# EAGLE schematic MCP3424 Temperature board V2 (EAGLE 7.5.0)
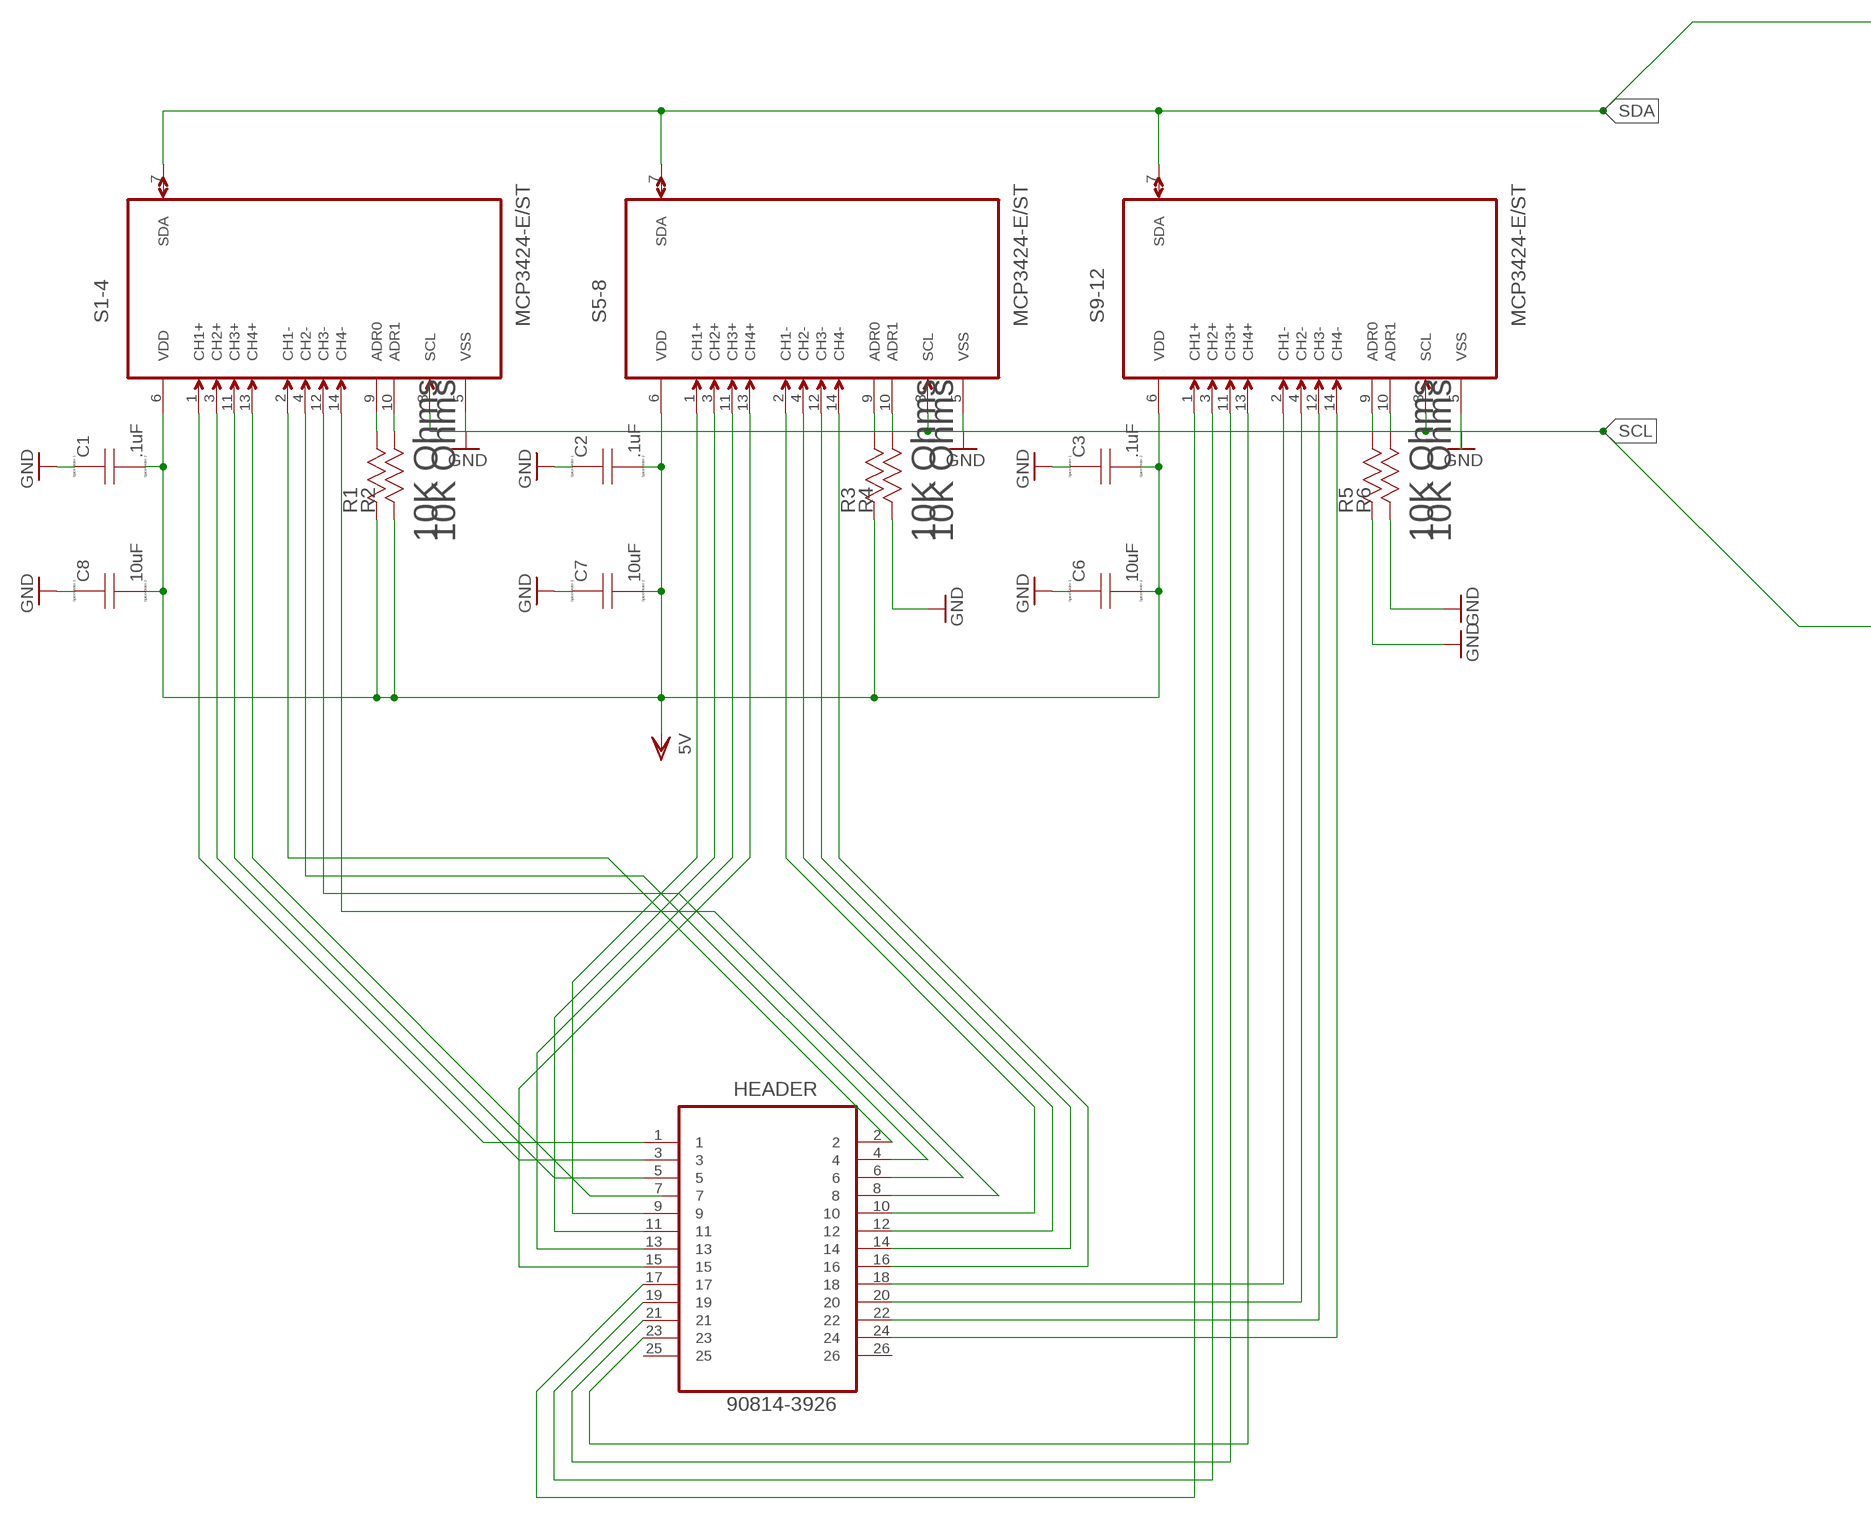
[diagram p0: schematic, sheet 1, part 1 of 2]
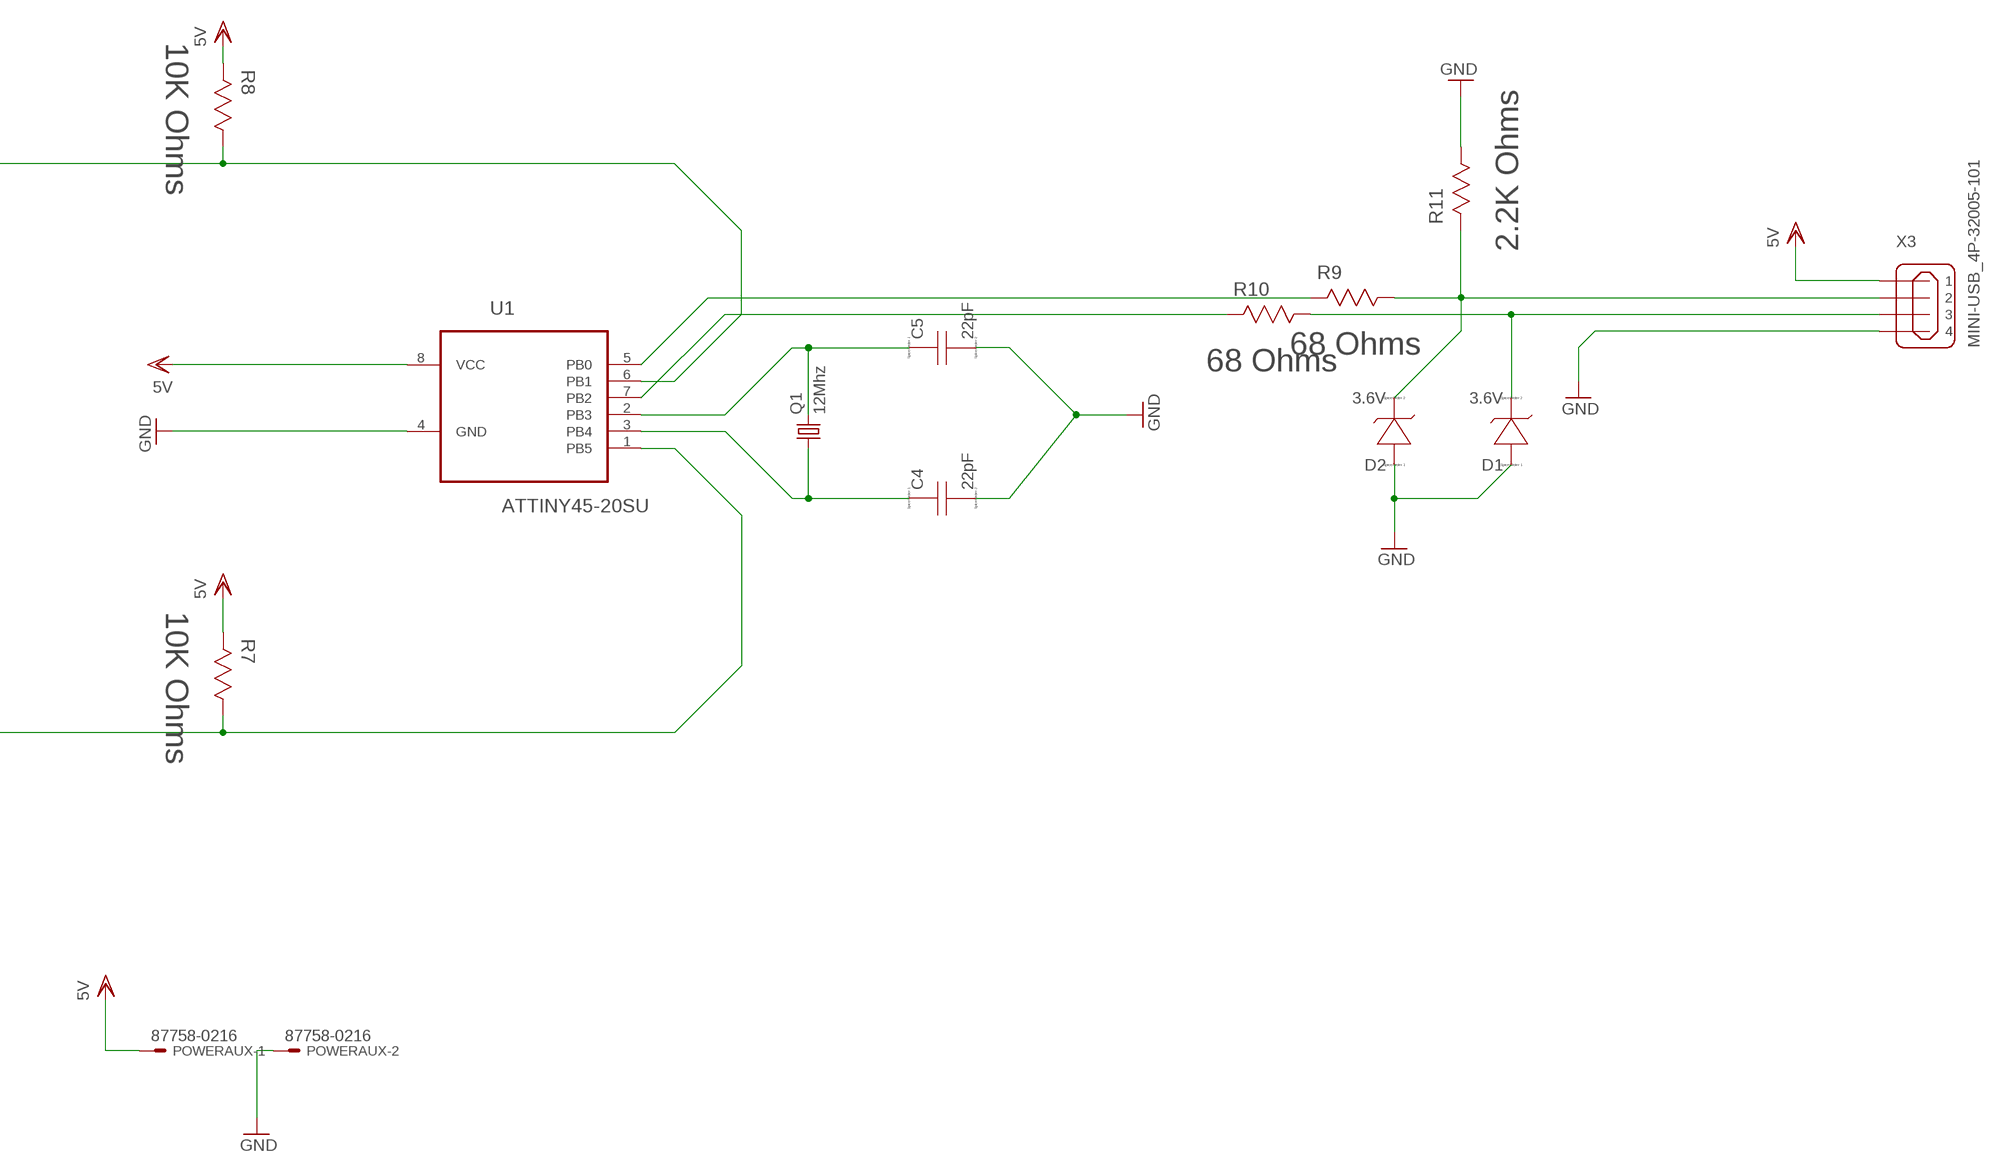
[diagram p1: schematic, sheet 1, part 2 of 2]

## Parts
C1  .1uF  CAP  [C0805]
C2  .1uF  CAP  [C0805]
C3  .1uF  CAP  [C0805]
C4  22pF  CAP  [C0805]
C5  22pF  CAP  [C0805]
C6  10uF  CAP  [C0805]
C7  10uF  CAP  [C0805]
C8  10uF  CAP  [C0805]
D1  3.6V  ZENER  [SOD123]
D2  3.6V  ZENER  [SOD123]
HEADER  90814-3926  [MOLEX_90814-3926]
POWERAUX  87758-0216  [87758-0216]
Q1  12Mhz  CRYSTALHC49UP  [HC49UP]
R1  10K Ohms  P0805Z1002WNT0079  [RESC2013X65N]
R2  10K Ohms  P0805Z1002WNT0079  [RESC2013X65N]
R3  10K Ohms  P0805Z1002WNT0079  [RESC2013X65N]
R4  10K Ohms  P0805Z1002WNT0079  [RESC2013X65N]
R5  10K Ohms  P0805Z1002WNT0079  [RESC2013X65N]
R6  10K Ohms  P0805Z1002WNT0079  [RESC2013X65N]
R7  10K Ohms  P0805Z1002WNT0079  [RESC2013X65N]
R8  10K Ohms  P0805Z1002WNT0079  [RESC2013X65N]
R9  68 Ohms  P0805Z1002WNT0079  [RESC2013X65N]
R10  68 Ohms  P0805Z1002WNT0079  [RESC2013X65N]
R11  2.2K Ohms  P0805Z1002WNT0079  [RESC2013X65N]
S1-4  MCP3424-E/ST  [SOP65P640X120-14N]
S5-8  MCP3424-E/ST  [SOP65P640X120-14N]
S9-12  MCP3424-E/ST  [SOP65P640X120-14N]
U1  ATTINY45-20SU  [SOIC127P798X216-8N]
X3  MINI-USB_4P-32005-101  [32005-101]

## Nets
GND: C1.1(A) C2.1(A) C3.1(A) C4.2(B) C5.2(B) C6.1(A) C7.1(A) C8.1(A) D1.A(+) D2.A(+) POWERAUX.2 R4.2 R5.2 R6.2 R11.1 S1-4.5(VSS) S5-8.5(VSS) U1.4(GND) X3.4
N$1: HEADER.1 S1-4.1(CH1+)
N$2: S9-12.5(VSS)
N$3: R1.1 S1-4.9(ADR0)
N$4: R2.1 S1-4.10(ADR1)
N$5: R3.1 S5-8.9(ADR0)
N$6: R4.1 S5-8.10(ADR1)
N$7: HEADER.3 S1-4.3(CH2+)
N$8: R5.1 S9-12.9(ADR0)
N$9: R6.1 S9-12.10(ADR1)
N$10: HEADER.5 S1-4.11(CH3+)
N$11: S1-4.13(CH4+)
N$12: HEADER.2 S1-4.2(CH1-)
N$13: HEADER.4 S1-4.4(CH2-)
N$14: HEADER.6 S1-4.12(CH3-)
N$15: HEADER.8 S1-4.14(CH4-)
N$16: HEADER.9 S5-8.1(CH1+)
N$17: HEADER.11 S5-8.3(CH2+)
N$18: HEADER.13 S5-8.11(CH3+)
N$19: HEADER.15 S5-8.13(CH4+)
N$20: HEADER.10 S5-8.2(CH1-)
N$21: HEADER.16 S5-8.14(CH4-)
N$22: HEADER.14 S5-8.12(CH3-)
N$23: HEADER.12 S5-8.4(CH2-)
N$24: HEADER.17 S9-12.1(CH1+)
N$25: HEADER.19 S9-12.3(CH2+)
N$26: HEADER.23 S9-12.13(CH4+)
N$27: HEADER.21 S9-12.11(CH3+)
N$28: HEADER.24 S9-12.14(CH4-)
N$29: HEADER.22 S9-12.12(CH3-)
N$30: HEADER.20 S9-12.4(CH2-)
N$31: HEADER.18 S9-12.2(CH1-)
N$33: R9.2 U1.5(PB0)
N$34: R10.2 U1.7(PB2)
N$35: D2.C(-) R9.1 R11.2 X3.2
N$36: D1.C(-) R10.1 X3.3
N$38: C4.1(A) Q1.1 U1.3(PB4)
N$39: C5.1(A) Q1.2 U1.2(PB3)
SCL: R7.1 S1-4.8(SCL) S5-8.8(SCL) S9-12.8(SCL) U1.1(PB5)
SDA: R8.1 S1-4.7(SDA) S5-8.7(SDA) S9-12.7(SDA) U1.6(PB1)
VDD: C1.2(B) C2.2(B) C3.2(B) C6.2(B) C7.2(B) C8.2(B) POWERAUX.1 R1.2 R2.2 R3.2 R7.2 R8.2 S1-4.6(VDD) S5-8.6(VDD) S9-12.6(VDD) U1.8(VCC) X3.1 ; supply symbol labelled 5V
Unconnected: HEADER.7 HEADER.25 HEADER.26

## Library data of the parts
C1-C3 = sym:CAP: Capacitor; MPN: C0805C104Z3VACTU; OC_NEWARK: 76Y2950
C4 C5 = sym:CAP: Capacitor; MPN: CC0805JRNPO9BN220; OC_NEWARK: 68R4857
C6-C8 = sym:CAP: Capacitor; MPN: NOJP106M006RWJ; OC_NEWARK: 97M6362
D1 D2 = sym:ZENER: Zener Diode; MPN: MM3Z3V6T1G; OC_NEWARK: 01P0395
HEADER = Molex_By_element14_Batch_1:90814-3926: CONN HEADER 26POS 1.27MM SMD GOLD; MF: MOLEX; MPN: 50-57-9002; OC_FARNELL: 1757067; OC_NEWARK: 77C5436; PACKAGE: CONN-26POS; SUPPLIER: Molex
POWERAUX = con-molex:87758-0216: 2 Pin - 2mm Dual Row Single Wafer, Vertical T/H HDR Source: http://www.molex.com/pdm_docs/sd/877580616_sd.pdf; MPN: 87758-0216; OC_FARNELL: unknown; OC_NEWARK: 94M1513
Q1 = crystal:CRYSTAL: CRYSTAL; MF: Abracon Corporation; MPN: ABLS-12.000MHZ-B2-T; OC_FARNELL: unknown; OC_NEWARK: 13J1654
R1-R8 = Vishay_By_element14_Batch_1:P0805Z1002WNT0079: RESISTOR, 0805; MF: VISHAY/DALE; MPN: CRCW080510K0JNEA; OC_FARNELL: 1791003; OC_NEWARK: 52K9797; SUPPLIER: Vishay; TOLERANCE: ± 0.05 %; WATTAGE: 200mW
R9 R10 = Vishay_By_element14_Batch_1:P0805Z1002WNT0079: RESISTOR, 0805; MPN: ERJ-B3BFR68V; OC_FARNELL: 1791003; OC_NEWARK: 32R9312; SUPPLIER: Vishay; TOLERANCE: ± 0.05 %; VALUE: 10K Ohms; WATTAGE: 200mW
R11 = Vishay_By_element14_Batch_1:P0805Z1002WNT0079: RESISTOR, 0805; MF: VISHAY/DALE; MPN: CRCW08052K20FKEA; OC_FARNELL: 1791003; OC_NEWARK: 52K9951; SUPPLIER: Vishay; TOLERANCE: ± 0.05 %; VALUE: 10K Ohms; WATTAGE: 200mW
S1-4 S5-8 S9-12 = Microchip_By_element14_Batch_1:MCP3424-E/ST: Analog-to-Digital Converter; MPN: MCP3424-E/ST; OC_FARNELL: 1630423; OC_NEWARK: 54M4872; PACKAGE: SOP-14; SUPPLIER: Microchip
U1 = Atmel_By_element14_Batch_1-00:ATTINY45-20SU: 8-bit Microcontroller with 4 Bytes In-System Programmable Flash; MPN: ATTINY45-20SU; OC_FARNELL: 1288353; OC_NEWARK: 68T3731; PACKAGE: SOIC-8; SUPPLIER: Atmel
X3 = con-cypressindustries:MINI-USB_4P-: MINI USB 4 Pol. Source: www.cypressindustries.com; MPN: 651005136421; OC_FARNELL: unknown; OC_NEWARK: 12T8884